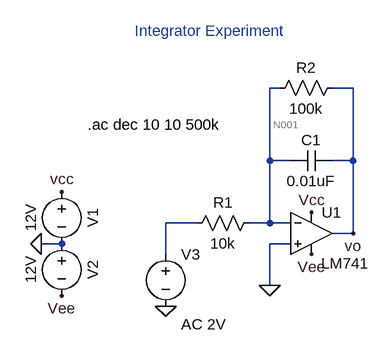
[diagram p0: schematic opampintegrator.asc]
opampintegrator.asc, the LTspice schematic file:
Version 4.1
SHEET 1 880 680
WIRE 432 -144 416 -144
WIRE 544 -144 512 -144
WIRE 416 -32 416 -144
WIRE 448 -32 416 -32
WIRE 544 -32 544 -144
WIRE 544 -32 512 -32
WIRE 304 64 256 64
WIRE 416 64 416 -32
WIRE 416 64 384 64
WIRE 448 64 416 64
WIRE 544 80 544 -32
WIRE 544 80 512 80
WIRE 96 96 64 96
WIRE 448 96 416 96
WIRE 256 112 256 64
WIRE 416 160 416 96
FLAG 64 96 0
FLAG 96 16 vcc
FLAG 96 176 Vee
FLAG 480 48 Vcc
FLAG 480 112 Vee
FLAG 416 160 0
FLAG 256 192 0
FLAG 544 80 vo
SYMBOL LM741 480 16 R0
WINDOW 3 15 110 Left 2
SYMATTR InstName U1
SYMBOL voltage 96 0 R0
WINDOW 0 32 56 VTop 2
WINDOW 3 -32 56 VBottom 2
WINDOW 123 0 0 Left 0
WINDOW 39 0 0 Left 0
SYMATTR InstName V1
SYMATTR Value 12V
SYMBOL voltage 96 80 R0
WINDOW 0 32 56 VTop 2
WINDOW 3 -32 56 VBottom 2
WINDOW 123 0 0 Left 0
WINDOW 39 0 0 Left 0
SYMATTR InstName V2
SYMATTR Value 12V
SYMBOL cap 512 -48 R90
WINDOW 0 0 32 VBottom 2
WINDOW 3 32 32 VTop 2
SYMATTR InstName C1
SYMATTR Value 0.01uF
SYMBOL res 400 48 R90
WINDOW 0 0 56 VBottom 2
WINDOW 3 32 56 VTop 2
SYMATTR InstName R1
SYMATTR Value 10k
SYMBOL res 528 -160 R90
WINDOW 0 0 56 VBottom 2
WINDOW 3 32 56 VTop 2
SYMATTR InstName R2
SYMATTR Value 100k
SYMBOL voltage 256 96 R0
WINDOW 123 24 124 Left 2
WINDOW 39 0 0 Left 0
SYMATTR InstName V3
SYMATTR Value ""
SYMATTR Value2 AC 2V
TEXT 208 -232 Left 2 ;Integrator Experiment
TEXT 136 -88 Left 2 !.ac dec 10 10 500k

The netlist it stands for:
* opampintegrator.asc
X§U1 0 N001 vcc Vee vo LM741  ; pins In+ In- V+ V- OUT
V1 vcc 0 12V
V2 0 Vee 12V
C1 vo N001 0.01uF
R1 N001 N002 10k
R2 vo N001 100k
V3 N002 0 AC 2V
* Integrator Experiment
.ac dec 10 10 500k
.lib LM741.lib
.backanno
.end

* Results of the author's LTspice run, read from the files saved beside the schematic
* Operating Point, zero values left out:
*   V(vcc) = 12 V
*   V(vo) = 21.19 mV
*   V(n001) = 999.9 µV
*   V(vee) = -12 V
*   I(V1) = -1.626 mA
*   I(R1) = 99.99 nA
*   I(V3) = 99.99 nA
*   I(R2) = 201.9 nA
*   I(V2) = -1.626 mA
*   Ix(u1:1) = 57.86 nA
*   Ix(u1:2) = 101.9 nA
*   Ix(u1:99) = 1.626 mA
*   Ix(u1:50) = -1.626 mA
*   Ix(u1:28) = -201.9 nA